# EAGLE schematic temp_new (EAGLE 7.5.0)
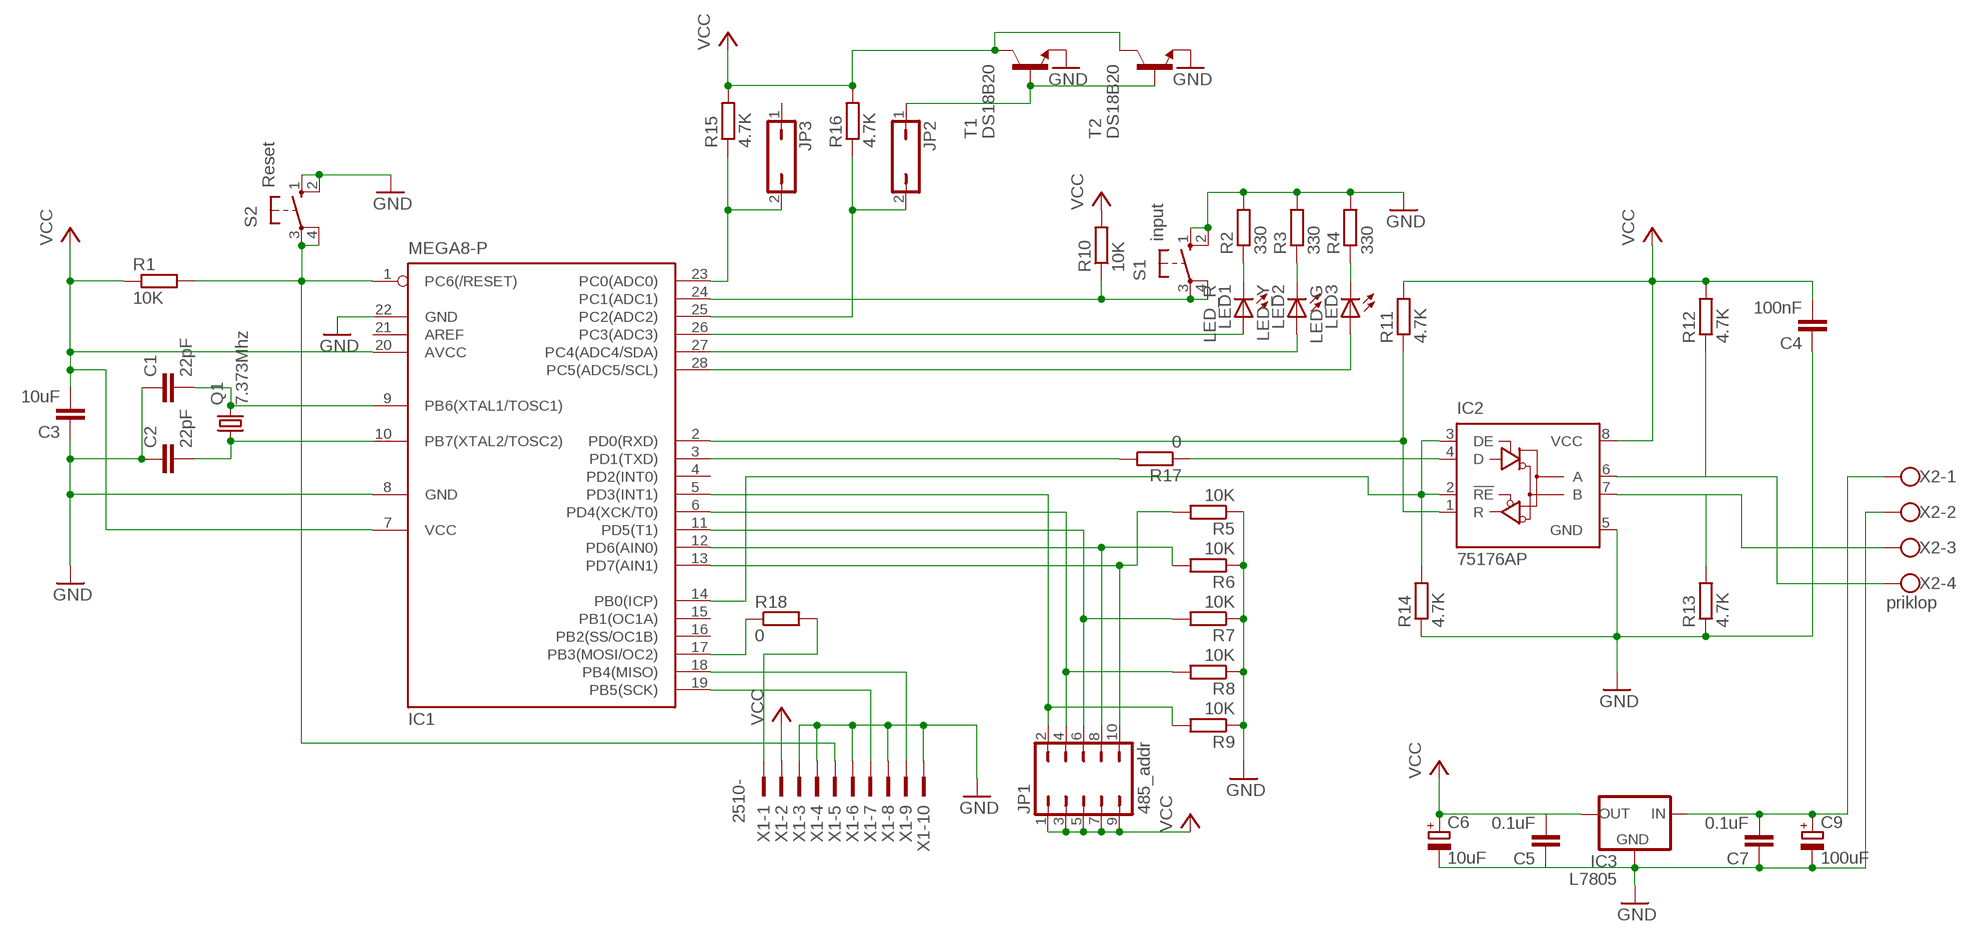
[diagram p0: schematic, sheet 1]

## Parts
C1  22pF  C-EU025-030X050  [C025-030X050]
C2  22pF  C-EU025-030X050  [C025-030X050]
C3  10uF  C-EU025-030X050  [C025-030X050]
C4  100nF  C-EU025-030X050  [C025-030X050]
C5  0.1uF  C-EU025-030X050  [C025-030X050]
C6  10uF  CPOL-EUE2.5-6  [E2,5-6]
C7  0.1uF  C-EU025-030X050  [C025-030X050]
C9  100uF  CPOL-EUE5-13  [E5-13]
IC1  MEGA8-P  [DIL28-3]
IC2  75176AP  [DIL08]
IC3  L7805  78XXL  [78XXL]
JP1  485_addr  JP5Q  [JP5Q]
JP2  JP1Q  [JP1]
JP3  JP1Q  [JP1]
LED1  LED_R  LED3MM  [LED3MM]
LED2  LED_Y  LED3MM  [LED3MM]
LED3  LED_G  LED3MM  [LED3MM]
Q1  7.373Mhz  CRYSTALHC49S  [HC49/S]
R1  10K  R-EU_0207/10  [0207/10]
R2  330  R-EU_0207/10  [0207/10]
R3  330  R-EU_0207/10  [0207/10]
R4  330  R-EU_0207/10  [0207/10]
R5  10K  R-EU_0207/10  [0207/10]
R6  10K  R-EU_0207/10  [0207/10]
R7  10K  R-EU_0207/10  [0207/10]
R8  10K  R-EU_0207/10  [0207/10]
R9  10K  R-EU_0207/10  [0207/10]
R10  10K  R-EU_0207/10  [0207/10]
R11  4.7K  R-EU_0207/10  [0207/10]
R12  4.7K  R-EU_0207/10  [0207/10]
R13  4.7K  R-EU_0207/10  [0207/10]
R14  4.7K  R-EU_0207/10  [0207/10]
R15  4.7K  R-EU_0207/10  [0207/10]
R16  4.7K  R-EU_0207/10  [0207/10]
R17  0  R-EU_0207/10  [0207/10]
R18  0  R-EU_0207/10  [0207/10]
S1  input  10-XX  [B3F-10XX]
S2  Reset  10-XX  [B3F-10XX]
T1  DS18B20  2N3565  [TO92]
T2  DS18B20  2N3565  [TO92]
X1  2510-  [PAK100/2500-10]
X2  priklop  W237-4  [W237-4]

## Nets
GND: C1.1 C2.1 C3.1 C4.1 C5.1 C6.- C7.1 C9.- IC1.8(GND) IC1.22(GND) IC2.5(GND) IC3.GND R2.2 R3.2 R4.2 R5.1 R6.1 R7.1 R8.1 R9.1 R13.1 R14.1 S1.1(S) S1.2(S1) S2.1(S) S2.2(S1) T1.3(E) T2.3(E) X1.3 X1.4 X1.6 X1.8 X1.10 X2.2
N$1: C1.2 IC1.9(PB6(XTAL1/TOSC1)) Q1.2
N$2: C2.2 IC1.10(PB7(XTAL2/TOSC2)) Q1.1
N$3: IC1.5(PD3(INT1)) JP1.2 R9.2
N$4: IC1.1(PC6(/RESET)) R1.2 S2.3(P) S2.4(P1) X1.5
N$5: IC1.17(PB3(MOSI/OC2)) R18.1
N$6: IC1.18(PB4(MISO)) X1.9
N$7: IC1.19(PB5(SCK)) X1.7
N$8: IC1.6(PD4(XCK/T0)) JP1.4 R8.2
N$9: IC1.11(PD5(T1)) JP1.6 R7.2
N$10: IC1.12(PD6(AIN0)) JP1.8 R6.2
N$11: IC1.13(PD7(AIN1)) JP1.10 R5.2
N$12: IC1.14(PB0(ICP)) IC2.2(!RE) IC2.3(DE) R14.2
N$13: IC2.4(D) R17.1
N$14: IC1.2(PD0(RXD)) IC2.1(R) R11.1
N$15: IC1.26(PC3(ADC3)) LED1.A
N$16: IC2.7(B) R13.2 X2.3
N$17: IC2.6(A) R12.1 X2.4
N$18: IC1.27(PC4(ADC4/SDA)) LED2.A
N$19: IC1.28(PC5(ADC5/SCL)) LED3.A
N$20: C7.2 C9.+ IC3.IN X2.1
N$21: IC1.24(PC1(ADC1)) R10.1 S1.3(P) S1.4(P1)
N$22: IC1.3(PD1(TXD)) R17.2
N$23: LED1.K(C) R2.1
N$24: LED2.K(C) R3.1
N$25: LED3.K(C) R4.1
N$26: IC1.23(PC0(ADC0)) JP3.2 R15.1
N$27: IC1.25(PC2(ADC2)) JP2.2 R16.1
N$28: JP2.1 T1.2(B) T2.2(B)
N$29: R18.2 X1.1
VCC: C3.2 C4.2 C5.2 C6.+ IC1.7(VCC) IC1.20(AVCC) IC2.8(VCC) IC3.OUT JP1.1 JP1.3 JP1.5 JP1.7 JP1.9 R1.1 R10.2 R11.2 R12.2 R15.2 R16.2 T1.1(C) T2.1(C) X1.2
Unconnected: IC1.4(PD2(INT0)) IC1.15(PB1(OC1A)) IC1.16(PB2(SS/OC1B)) IC1.21(AREF) JP3.1

## Library data of the parts
C1-C5 C7 = rcl:C-EU: CAPACITOR, European symbol
C6 C9 = rcl:CPOL-EU: POLARIZED CAPACITOR, European symbol
IC1 = atmel:MEGA8-P: MICROCONTROLLER 8 Kbytes FLASH, 1 kbytes SRAM, 512 bytes EEPROM, USART, 4-channel 10 bit ADC, 2-channel 8 bit ADC Pin compatible with Atmega48, ATMega88, ATMega168 Source: avr.lbr; OC_FARNELL: unknown; OC_NEWARK: unknown
IC2 = 751xx:75176A: DIFFERENTIAL BUS TRANSCEIVER Source: http://focus.ti.com/lit/ds/symlink/sn75176a.pdf
IC3 = v-reg:78XXL: VOLTAGE REGULATOR
JP1 = jumper:JP5Q: JUMPER
JP2 JP3 = jumper:JP1Q: JUMPER
LED1-LED3 = led:LED: LED OSRAM: - CHIPLED LG R971, LG N971, LY N971, LG Q971, LY Q971, LO R971, LY R971 LH N974, LH R974 LS Q976, LO Q976, LY Q976 LO Q996 - Hyper CHIPLED LW Q18S LB Q993, LB Q99A, LB R99A - SideLED LS A670, LO A670, LY A670, LG A670, LP A670 LB A673, LV A673, LT A673, LW A673 LH A674 LY A675 LS A676, LA A676, LO A676, LY A676, LW A676 LS A679, LY A679, LG A679 - Hyper Micro SIDELED® LS Y876, LA Y876, LO Y876, LY Y876 LT Y87S - SmartLED LW L88C, LW L88S LB L89C, LB L89S, LG L890 LS L89K, LO L89K, LY L89K LS L896, LA L896, LO L896, LY L896 - TOPLED LS T670, LO T670, LY T670, LG T670, LP T670 LSG T670, LSP T670, LSY T670, LOP T670, LYG T670 LG T671, LOG T671, LSG T671 LB T673, LV T673, LT T673, LW T673 LH T674 LS T676, LA T676, LO T676, LY T676, LB T676, LH T676, LSB T676, LW T676 LB T67C, LV T67C, LT T67C, LS T67K, LO T67K, LY T67K, LW E67C LS E67B, LA E67B, LO E67B, LY E67B, LB E67C, LV E67C, LT E67C LW T67C LS T679, LY T679, LG T679 LS T770, LO T770, LY T770, LG T770, LP T770 LB T773, LV T773, LT T773, LW T773 LH T774 LS E675, LA E675, LY E675, LS T675 LS T776, LA T776, LO T776, LY T776, LB T776 LHGB T686 LT T68C, LB T68C - Hyper Mini TOPLED® LB M676 - Mini TOPLED Santana® LG M470 LS M47K, LO M47K, LY M47K Source: http://www.osram.convergy.de LUXEON: - LUMILED® LXK2-PW12-R00, LXK2-PW12-S00, LXK2-PW14-U00, LXK2-PW14-V00 LXK2-PM12-R00, LXK2-PM12-S00, LXK2-PM14-U00 LXK2-PE12-Q00, LXK2-PE12-R00, LXK2-PE12-S00, LXK2-PE14-T00, LXK2-PE14-U00 LXK2-PB12-K00, LXK2-PB12-L00, LXK2-PB12-M00, LXK2-PB14-N00, LXK2-PB14-P00, LXK2-PB14-Q00 LXK2-PR12-L00, LXK2-PR12-M00, LXK2-PR14-Q00, LXK2-PR14-R00 LXK2-PD12-Q00, LXK2-PD12-R00, LXK2-PD12-S00 LXK2-PH12-R00, LXK2-PH12-S00 LXK2-PL12-P00, LXK2-PL12-Q00, LXK2-PL12-R00 Source: www.luxeon.com KINGBRIGHT: KA-3528ASYC Source: www.kingbright.com
Q1 = crystal:CRYSTAL: CRYSTAL; OC_FARNELL: 1667008; OC_NEWARK: unknown
R1-R18 = rcl:R-EU_: RESISTOR, European symbol
S1 S2 = switch-omron:10-XX: OMRON SWITCH; MPN: B3F-1000; OC_FARNELL: 176432; OC_NEWARK: 36M3542
T1 T2 = transistor:2N3565: NPN TRANSISTOR
X1 = con-3m:2510-: 3M (TM) Pak 100 4-Wall Header Source: 3M; MF: 3M; MPN: 2510-6002UB; OC_FARNELL: 9838244; OC_NEWARK: 46F4725
X2 = con-wago-500:W237-4: WAGO SCREW CLAMP; OC_FARNELL: unknown; OC_NEWARK: unknown